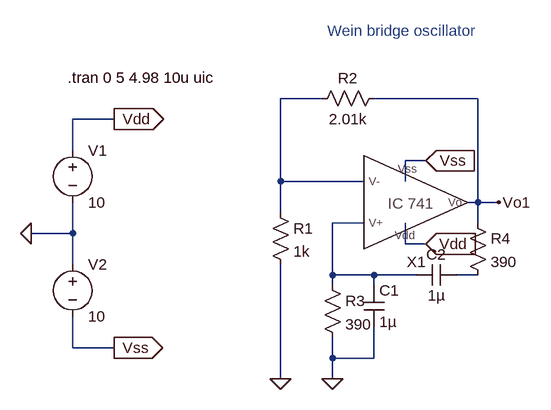
[diagram p0: schematic wein bridge oscillator.asc]
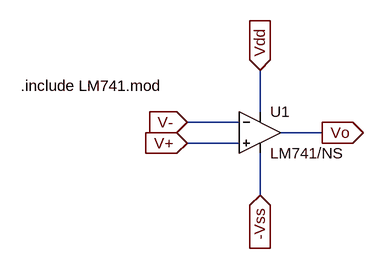
[diagram p1: sub-circuit ic741.asc]
wein bridge oscillator.asc, the LTspice schematic file:
Version 4
SHEET 1 928 680
WIRE 352 16 288 16
WIRE 592 16 432 16
WIRE 32 48 -32 48
WIRE -32 96 -32 48
WIRE 512 112 480 112
WIRE 288 144 288 16
WIRE 416 144 288 144
WIRE 480 144 480 112
WIRE 592 176 592 16
WIRE 592 176 576 176
WIRE 624 176 592 176
WIRE 288 192 288 144
WIRE 416 208 368 208
WIRE 592 208 592 176
WIRE -32 224 -32 176
WIRE -32 224 -96 224
WIRE 480 240 480 208
WIRE 512 240 480 240
WIRE -32 272 -32 224
WIRE 368 288 368 208
WIRE 432 288 368 288
WIRE 496 288 432 288
WIRE 592 288 560 288
WIRE 368 304 368 288
WIRE 432 304 432 288
WIRE -32 400 -32 352
WIRE 32 400 -32 400
WIRE 368 416 368 384
WIRE 432 416 432 368
WIRE 432 416 368 416
WIRE 288 448 288 272
WIRE 368 448 368 416
FLAG -96 224 0
FLAG 32 48 Vdd
IOPIN 32 48 Out
FLAG 32 400 Vss
IOPIN 32 400 Out
FLAG 512 112 Vss
IOPIN 512 112 In
FLAG 512 240 Vdd
IOPIN 512 240 In
FLAG 624 176 Vo1
FLAG 368 448 0
FLAG 288 448 0
SYMBOL IC741 496 160 M180
SYMATTR InstName X1
SYMBOL voltage -32 80 R0
WINDOW 123 0 0 Left 0
WINDOW 39 0 0 Left 0
SYMATTR InstName V1
SYMATTR Value 10
SYMBOL voltage -32 256 R0
WINDOW 123 0 0 Left 0
WINDOW 39 0 0 Left 0
SYMATTR InstName V2
SYMATTR Value 10
SYMBOL res 272 176 R0
SYMATTR InstName R1
SYMATTR Value 1k
SYMBOL res 448 0 R90
WINDOW 0 0 56 VBottom 2
WINDOW 3 32 56 VTop 2
SYMATTR InstName R2
SYMATTR Value 2.01k
SYMBOL cap 416 304 R0
SYMATTR InstName C1
SYMATTR Value 1µ
SYMBOL res 352 288 R0
SYMATTR InstName R3
SYMATTR Value 390
SYMBOL res 576 192 R0
SYMATTR InstName R4
SYMATTR Value 390
SYMBOL cap 560 272 R90
WINDOW 0 0 32 VBottom 2
WINDOW 3 32 32 VTop 2
SYMATTR InstName C2
SYMATTR Value 1µ
TEXT 360 -88 Left 2 ;Wein bridge oscillator
TEXT -40 -16 Left 2 !.tran 0 5 4.98 10u uic

ic741.asc, the sub-circuit schematic file:
Version 4
SHEET 1 880 680
WIRE 368 128 368 64
WIRE 336 144 256 144
WIRE 464 160 400 160
WIRE 336 176 256 176
WIRE 368 256 368 192
FLAG 464 160 Vo
IOPIN 464 160 Out
FLAG 368 64 Vdd
IOPIN 368 64 In
FLAG 368 256 -Vss
IOPIN 368 256 In
FLAG 256 176 V+
IOPIN 256 176 In
FLAG 256 144 V-
IOPIN 256 144 In
SYMBOL OpAmps\\opamp2 368 96 R0
SYMATTR InstName U1
SYMATTR Value LM741/NS
TEXT 0 88 Left 2 !.include LM741.mod

The netlist it stands for:
* wein bridge oscillator.asc
XX1 Vss N002 N001 Vdd Vo1 ic741
V1 Vdd 0 10
V2 0 Vss 10
R1 N001 0 1k
R2 Vo1 N001 2.01k
C1 N002 0 1µ
R3 N002 0 390
R4 Vo1 N003 390
C2 N003 N002 1µ

* block symbol definitions
.subckt ic741 -Vss V+ V- Vdd Vo
XU1 V+ V- Vdd -Vss Vo LM741/NS  ; pins In+ In- V+ V- OUT
.include LM741.mod
.ends ic741

* Wein bridge oscillator
.tran 0 5 4.98 10u uic
.backanno
.end